# EAGLE design main_shema (EAGLE 9.2.1)
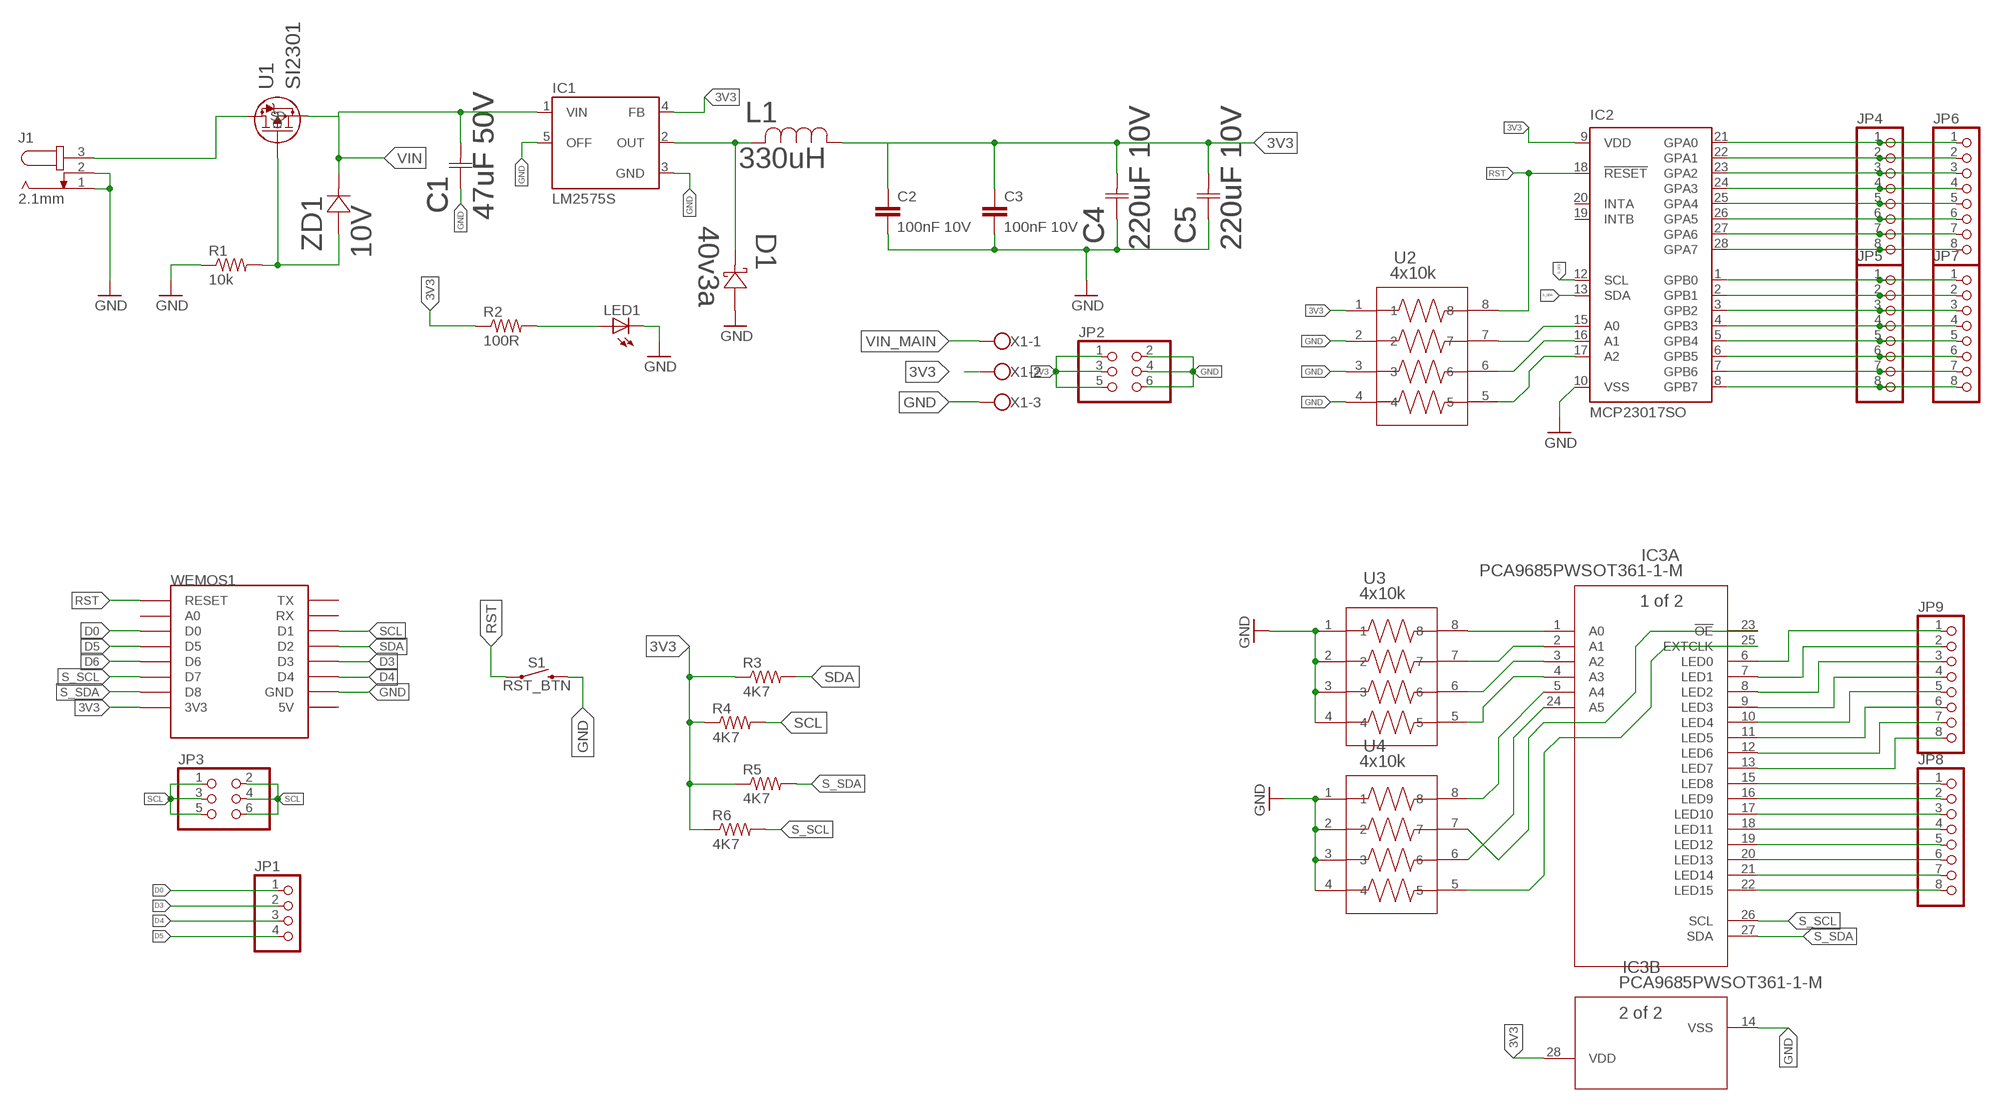
[diagram p0: schematic, sheet 1, part 1 of 2]
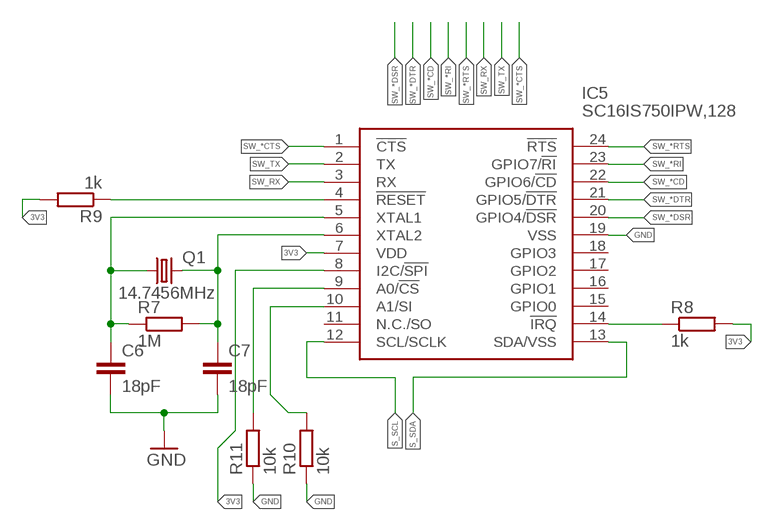
[diagram p1: schematic, sheet 1, part 2 of 2]

## Parts
C1  47uF 50V  EEE-1HA470XPCAP_EEE_D8-M  [CAP_EEE_D8-M]
C2  100nF 10V  C-EUC0603  [C0603]
C3  100nF 10V  C-EUC0603  [C0603]
C4  220uF 10V  EEE-0JA221WPCAP_EEE_D-M  [CAP_EEE_D-M]
C5  220uF 10V  EEE-0JA221WPCAP_EEE_D-M  [CAP_EEE_D-M]
C6  18pF  CAP0402-CAP  [0402-CAP]
C7  18pF  CAP0402-CAP  [0402-CAP]
D1  40v3a  CDBA340-HFCDBA-HF-M  [CDBA-HF-M]
IC1  LM2575S  [TO263-5]
IC2  MCP23017SO  [SO28W]
IC3  PCA9685PWSOT361-1-M  [SOT361-1-M]
IC5  SC16IS750IPW,128  [SOP65P640X110-24N]
J1  2.1mm  JACK-PLUG1  [SPC4078]
JP1  PINHD-1X4  [1X04]
JP2  PINHD-2X3  [2X03]
JP3  PINHD-2X3  [2X03]
JP4  PINHD-1X8  [1X08]
JP5  PINHD-1X8  [1X08]
JP6  PINHD-1X8  [1X08]
JP7  PINHD-1X8  [1X08]
JP8  PINHD-1X8/LONG  [1X08]
JP9  PINHD-1X8/LONG  [1X08]
L1  330uH  SRR1280-331K  [IND_BOURNS_SRR1280]
LED1  LED_E  [LED_1206]
Q1  14.7456MHz  CRYSTAL5X3  [CRYSTAL-SMD-5X3]
R1  10k  R-US_R0603  [R0603]
R2  100R  R-US_R0603  [R0603]
R3  4K7  R-US_R0603  [R0603]
R4  4K7  R-US_R0603  [R0603]
R5  4K7  R-US_R0603  [R0603]
R6  4K7  R-US_R0603  [R0603]
R7  1M  R-EU_R0402  [R0402]
R8  1k  R-EU_R0402  [R0402]
R9  1k  R-EU_R0402  [R0402]
R10  10k  R-EU_R0402  [R0402]
R11  10k  R-EU_R0402  [R0402]
S1  RST_BTN  MOMENTARY-SWITCH-SPST-PTH-6.0MM  [TACTILE_SWITCH_PTH_6.0MM]
U1  SI2301  SI2301CDS-T1-GE3TO-236-M  [TO-236-M]
U2  4x10k  EXB-38V103JV  [C_ARRAY_EXB38V]
U3  4x10k  EXB-38V103JVC_ARRAY_EXB38V-M  [C_ARRAY_EXB38V-M]
U4  4x10k  EXB-38V103JVC_ARRAY_EXB38V-M  [C_ARRAY_EXB38V-M]
WEMOS1  WEMOS-D1-MINI  [WEMOS-D1-MINI]
X1  W237-103  [W237-103]
ZD1  10V  DZ2J100M0LSMINI2-F5-B-M  [SMINI2-F5-B-M]

## Nets
3V3: C2.1 C3.1 C4.2 C5.2 IC1.4(FB) IC2.9(VDD) IC3.28(B:VDD) IC5.7(VDD) IC5.8(I2C/!SPI) JP2.1 JP2.3 JP2.5 L1.1 R2.1 R3.1 R4.1 R5.1 R6.1 R8.2 R9.2 U2.1 WEMOS1.3V3 X1.2
D0: JP1.1 WEMOS1.D0
D3: JP1.2 WEMOS1.D3
D4: JP1.3 WEMOS1.D4
D5: JP1.4 WEMOS1.D5
D6: WEMOS1.D6
GND: C1.1 C2.2 C3.2 C4.1 C5.1 C6.2 C7.2 D1.2 IC1.3(GND) IC1.5(OFF) IC2.10(VSS) IC3.14(B:VSS) IC5.19(VSS) J1.1 J1.2 JP2.2 JP2.4 JP2.6 LED1.C R1.1 R10.1 R11.1 S1.3 U2.2 U2.3 U2.4 U3.1 U3.2 U3.3 U3.4 U4.1 U4.2 U4.3 U4.4 WEMOS1.GND X1.3
N$1: LED1.A R2.2
N$2: R1.2 U1.1(G) ZD1.2
N$3: IC2.21(GPA0) JP4.1 JP6.1
N$4: IC2.22(GPA1) JP4.2 JP6.2
N$5: IC3.6(A:LED0) JP9.1
N$6: IC3.7(A:LED1) JP9.2
N$7: IC3.8(A:LED2) JP9.3
N$8: D1.1 IC1.2(OUT) L1.2
N$9: IC2.15(A0) U2.7
N$10: IC3.9(A:LED3) JP9.4
N$11: IC2.23(GPA2) JP4.3 JP6.3
N$12: IC2.16(A1) U2.6
N$13: IC2.17(A2) U2.5
N$14: IC3.10(A:LED4) JP9.5
N$15: IC2.24(GPA3) JP4.4 JP6.4
N$16: IC2.25(GPA4) JP4.5 JP6.5
N$17: IC2.26(GPA5) JP4.6 JP6.6
N$18: IC3.11(A:LED5) JP9.6
N$19: IC3.12(A:LED6) JP9.7
N$20: IC3.13(A:LED7) JP9.8
N$21: IC2.27(GPA6) JP4.7 JP6.7
N$22: IC2.28(GPA7) JP4.8 JP6.8
N$23: IC2.1(GPB0) JP5.1 JP7.1
N$24: IC2.2(GPB1) JP5.2 JP7.2
N$25: IC2.3(GPB2) JP5.3 JP7.3
N$26: IC2.4(GPB3) JP5.4 JP7.4
N$27: IC2.5(GPB4) JP5.5 JP7.5
N$28: IC2.6(GPB5) JP5.6 JP7.6
N$29: IC2.7(GPB6) JP5.7 JP7.7
N$30: IC2.8(GPB7) JP5.8 JP7.8
N$31: IC3.15(A:LED8) JP8.1
N$32: IC3.16(A:LED9) JP8.2
N$33: IC3.17(A:LED10) JP8.3
N$34: IC3.18(A:LED11) JP8.4
N$35: IC3.19(A:LED12) JP8.5
N$36: IC3.20(A:LED13) JP8.6
N$37: IC3.21(A:LED14) JP8.7
N$38: IC3.22(A:LED15) JP8.8
N$39: IC3.1(A:A0) U3.8
N$40: IC3.2(A:A1) U3.7
N$41: IC3.3(A:A2) U3.6
N$42: IC3.4(A:A3) U3.5
N$43: IC3.5(A:A4) U4.8
N$44: IC3.24(A:A5) U4.6
N$45: IC3.23(A:!OE) U4.7
N$46: IC3.25(A:EXTCLK) U4.5
N$47: C6.1 IC5.5(XTAL1) Q1.1 R7.1
N$48: C7.1 IC5.6(XTAL2) Q1.3 R7.2
N$49: IC5.4(!RESET) R9.1
N$50: IC5.14(!IRQ) R8.1
N$51: IC5.9(A0/!CS) R11.2
N$52: IC5.10(A1/SI) R10.2
RST: IC2.18(!RESET) S1.1 U2.8 WEMOS1.RESET
S_SCL: IC2.12(SCL) IC3.26(A:SCL) IC5.12(SCL/SCLK) R6.2 WEMOS1.D7
S_SDA: IC2.13(SDA) IC3.27(A:SDA) IC5.13(SDA/VSS) R5.2 WEMOS1.D8
SCL: JP3.1 JP3.3 JP3.5 R4.2 WEMOS1.D1
SDA: JP3.2 JP3.4 JP3.6 R3.2 WEMOS1.D2
SW_*CD: IC5.22(GPIO6/!CD)
SW_*CTS: IC5.1(!CTS)
SW_*DSR: IC5.20(GPIO4/!DSR)
SW_*DTR: IC5.21(GPIO5/!DTR)
SW_*RI: IC5.23(GPIO7/!RI)
SW_*RTS: IC5.24(!RTS)
SW_RX: IC5.3(RX)
SW_TX: IC5.2(TX)
VIN: C1.2 IC1.1(VIN) U1.2(S) ZD1.1
VIN_MAIN: J1.3 U1.3(D) X1.1
Unconnected: IC2.19(INTB) IC2.20(INTA) IC5.11(N.C./SO) IC5.15(GPIO0) IC5.16(GPIO1) IC5.17(GPIO2) IC5.18(GPIO3) WEMOS1.5V WEMOS1.A0 WEMOS1.RX WEMOS1.TX

## Library data of the parts
C1 = Custom Parts by IcE:EEE-1HA470XP; MANUFACTURER_PART_NUMBER: EEE1HA470XP; VENDOR: Panasonic
C2 C3 = rcl:C-EU: CAPACITOR, European symbol
C4 C5 = Custom Parts by IcE:EEE-0JA221WP; MANUFACTURER_PART_NUMBER: EEE0JA221WP; VENDOR: Panasonic
C6 C7 = SparkFun:CAP: Capacitor Standard 0603 ceramic capacitor, and 0.1" leaded capacitor.
D1 = Custom Parts by IcE:CDBA340-HF; MANUFACTURER_PART_NUMBER: CDBA340HF; VENDOR: Comchip
IC1 = v-reg-3:LM2575: National Semiconductor <http://www.national.com> 1.0A "Simple Switcher"(c) 52kHz, Vout 1.23-37V (HV: 57V), Vin 40V (HV: 60V), 50µA standby current
IC2 = microchip:MCP23017: http://ww1.microchip.com/downloads/en/DeviceDoc/21952a.pdf Source: http://ww1.microchip.com/downloads/en/DeviceDoc/21952a.pdf; MF: MICROCHIP; MPN: MCP23017-E/SO; OC_FARNELL: 1332087; OC_NEWARK: 31K2958
IC3 = Custom Parts by IcE:PCA9685PW; MANUFACTURER_PART_NUMBER: PCA9685PW; VENDOR: NXP
IC5 = SC16IS750IPW_128:SC16IS750IPW,128: NXP - SC16IS750IPW,128 - SINGLE UART FIFO 5MBPS 3.6V TSSOP-24, FULL REEL Source: Datasheet <https://componentsearchengine.com/Datasheets/2/SC16IS750IPW,128.pdf>; DESCRIPTION: NXP - SC16IS750IPW,128 - SINGLE UART FIFO 5MBPS 3.6V TSSOP-24, FULL REEL; HEIGHT: 1.1mm; MANUFACTURER_NAME: NXP; MANUFACTURER_PART_NUMBER: SC16IS750IPW,128
J1 = con-jack:JACK-PLUG: DC POWER JACK Power Jack, DC, Right Angle, Through Hole, Rated 5A at 16VDC, PC Terminals Distributor: Farnell (www.Farnell.de) Drawing: 84N1161.pdf / 84N1162.pdf Manufacturer: SPC Technology (www.spctechnology.com) Type: SPC4077 / SPC 4078; OC_FARNELL: unknown; OC_NEWARK: unknown
JP1 = pinhead:PINHD-1X4: PIN HEADER
JP2 JP3 = pinhead_2:PINHD-2X3: PIN HEADER
JP4-JP7 = pinhead_2:PINHD-1X8: PIN HEADER
JP8 JP9 = pinhead_v2:PINHD-1X8: PIN HEADER
L1 = Custom Parts by IcE:SRR1280-331K; MANUFACTURER_PART_NUMBER: SRR1280331K; VENDOR: Bourns Electronics
LED1 = eagle-ltspice:LED_E: LED Source: http://www.osram.convergy.de Source: www.luxeon.com Source: www.kingbright.com; SPICEMODEL: NONE; SPICEPREFIX: D; SPICETYPE: diode
Q1 = SparkFun:CRYSTAL: Crystals Various standard crystals. Proven footprints. Spark Fun Electronics SKU : COM-00534
R1-R6 = rcl:R-US_: RESISTOR, American symbol
R7-R11 = rcl:R-EU_: RESISTOR, European symbol; SPICEPREFIX: R
S1 = SparkFun-Switches:MOMENTARY-SWITCH-SPST: Momentary Switch (Pushbutton) - SPST Normally-open (NO) SPST momentary switches (buttons, pushbuttons). Variants PTH-12MM - 12mm square, through-hole Momentary Pushbutton Switch - 12mm Square <https://www.sparkfun.com/products/9190> (COM-09190) PTH-6.0MM, PTH-6.0MM-KIT - 6.0mm square, through-hole Mini Pushbutton Switch <https://www.sparkfun.com/products/97> (COM-00097) KIT package intended for soldering kit's - only one side of pads' copper is exposed. PTH-RIGHT-ANGLE-KIT - Right-angle, through-hole Right Angle Tactile Button <https://www.sparkfun.com/products/10791> - Used on SparkFun BigTime Watch Kit <https://www.sparkfun.com/products/11734> SMD-12MM - 12mm square, surface-mount Tactile Button - SMD (12mm) <https://www.sparkfun.com/products/12993> (COM-12993) Used on SparkFun PicoBoard <https://www.sparkfun.com/products/11888> SMD-4.5MM - 4.5mm Square Trackball Switch Used on SparkFun Blackberry Trackballer Breakout <https://www.sparkfun.com/products/13169> SMD-4.6MMX2.8MM - 4.60mm x 2.80mm, surface mount Used on SparkFun SAMD21 Mini Breakout <https://www.sparkfun.com/products/13664> SMD-5.2MM, SMD-5.2-REDUNDANT - 5.2mm square, surface-mount Mini Pushbutton Switch - SMD <https://www.sparkfun.com/products/8720> (COM-08720) Used on Arduino Pro Mini <https://www.sparkfun.com/products/11114> REDUNDANT package connects both switch circuits together SMD-6.0X3.5MM - 6.0 x 3.5mm, surface mount Momentary Reset Switch SMD <https://www.sparkfun.com/products/8229> (COM-08229) SMD-6.2MM-TALL - 6.2mm square, surface mount Tactile Button - SMD (6mm) <https://www.sparkfun.com/products/12992> Used on SparkFun Digital Sandbox <https://www.sparkfun.com/products/12651> SMD-RIGHT-ANGLE - Right-angle, surface mount Used on SparkFun Block for Intel® Edison - Arduino <https://www.sparkfun.com/products/13036>; PROD_ID: SWCH-08441; SF_SKU: COM-00097
U1 = Custom Parts by IcE:SI2301CDS-T1-GE3; MANUFACTURER_PART_NUMBER: SI2301CDST1GE3; VENDOR: Vishay
U2-U4 = Custom Parts by IcE:EXB-38V103JV; MANUFACTURER_PART_NUMBER: EXB38V103JV; VENDOR: Panasonic
WEMOS1 = esp8266modules:WEMOS-D1-MINI: WeMos.cc D1 mini ESP8266 module
X1 = con-wago-500:W237-103: WAGO SCREW CLAMP; MPN: 237-103; OC_FARNELL: unknown; OC_NEWARK: 18M7116
ZD1 = Custom Parts by IcE:DZ2J100M0L; MANUFACTURER_PART_NUMBER: DZ2J100M0L; VENDOR: Panasonic

## Board
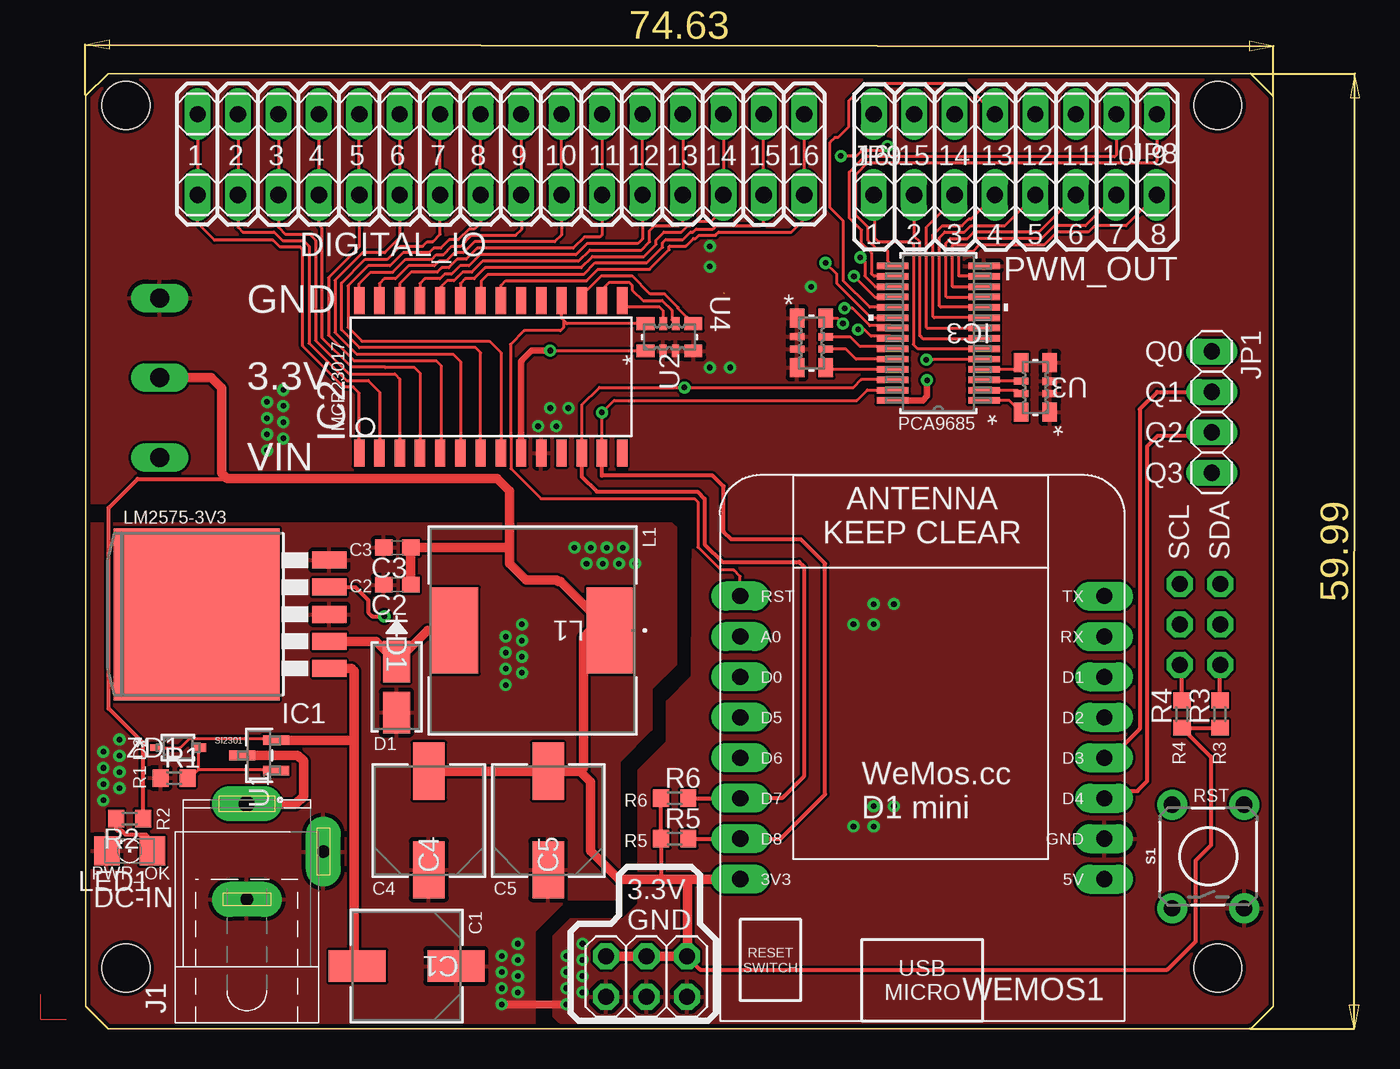
[diagram p2: board, top side]
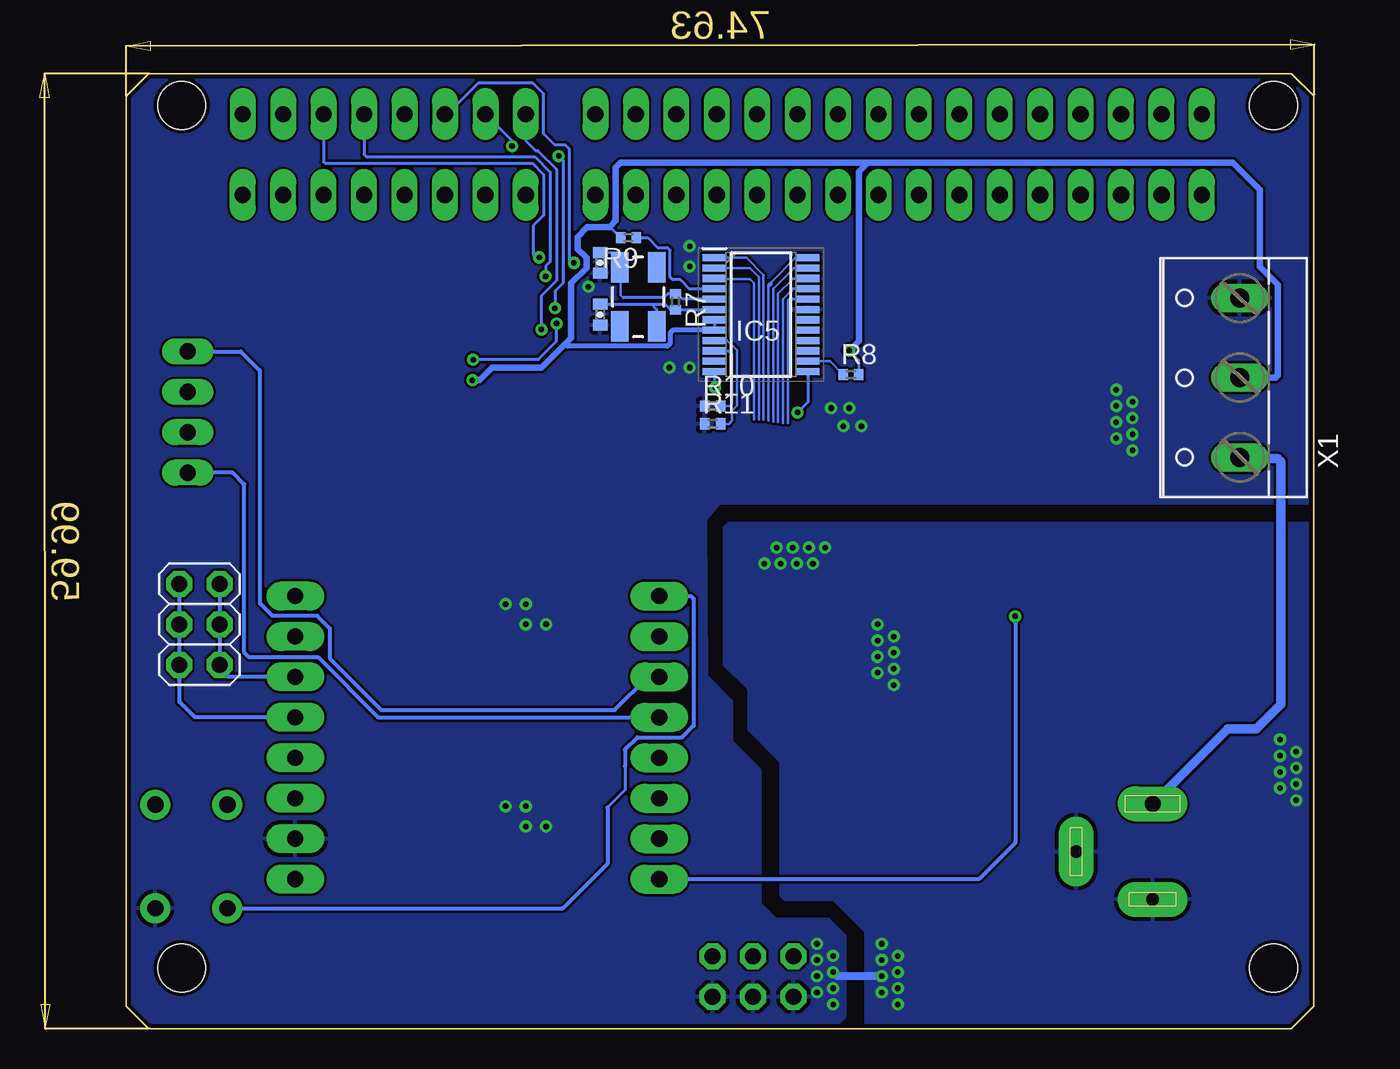
[diagram p3: board, bottom side, seen from below]

Size 74.6 x 60 mm. Coordinates in mm from the lower left corner, seen from the top.
Outline: 73.15,59.99 1.42,60 0,58.62 0,1.93 0,1.42 1.42,0 1.63,0 73.15,0 73.18,0 74.6,1.42 74.6,58.57
Outline: 73.15,59.99 73.16,60
Outline: 74.6,58.57 74.6,58.57
Outline: 73.15,59.99 73.18,59.99 74.6,58.57
Outline: 74.6,0 74.6,0
Copper layers (1*16): Top 0.035mm / dielectric 1.5mm / Bottom 0.035mm
Design rules "default *": minimum track width 6mil, minimum drill 0.2mm, track to track 6mil, track to pad 6mil, pad to pad 6mil, via to via 6mil, smd to smd 6mil, copper to edge 10mil, drill to drill 6mil, minimum pad ring 12mil, minimum via ring 8mil, stop-mask expansion 4mil, vias tented up to drill 0mil, thermal gap 10mil
Holes 3 mm at 2.54,3.81 2.54,58 71.12,58 71.12,3.81

### Footprints (pad centres in the part's own frame; a part is rotated, then mirrored left to right if it is on the bottom)
CAP_EEE_D8-M = smd 3.581 x 1.981: 1 -3.099,0; 2 3.099,0
C0603 = smd 1.1 x 1: 1 -0.85,0; 2 0.85,0
CAP_EEE_D-M = smd 3.581 x 1.981: 1 -3.099,0; 2 3.099,0
0402-CAP = smd 0.7 x 0.9: 1 -0.65,0; 2 0.65,0
CDBA-HF-M = smd 2.616 x 1.702: 1 -1.6,0; 2 1.6,0
TO263-5 = smd 1.067 x 2.159: 1 -3.404,-5.791; 2 -1.702,-5.791; 3 0,-5.791; 4 1.702,-5.791; 5 3.404,-5.791 | smd 10.8 x 10.41: 6 0,2.54
SO28W = smd 0.65 x 1.7: 1 -7.62,-4.78; 2 -6.35,-4.78; 3 -5.08,-4.78; 4 -3.81,-4.78; 5 -2.54,-4.78; 6 -1.27,-4.78; 7 0,-4.78; 8 1.27,-4.78; 9 2.54,-4.78; 10 3.81,-4.78; 11 5.08,-4.78; 12 6.35,-4.78; 13 7.62,-4.78; 14 8.89,-4.78; 15 8.89,4.78; 16 7.62,4.78; 17 6.35,4.78; 18 5.08,4.78; 19 3.81,4.78; 20 2.54,4.78; 21 1.27,4.78; 22 0,4.78; 23 -1.27,4.78; 24 -2.54,4.78; 25 -3.81,4.78; 26 -5.08,4.78; 27 -6.35,4.78; 28 -7.62,4.78
SOT361-1-M = smd 1.981 x 0.406: 1 -2.87,4.225; 2 -2.87,3.575; 3 -2.87,2.925; 4 -2.87,2.275; 5 -2.87,1.625; 6 -2.87,0.975; 7 -2.87,0.325; 8 -2.87,-0.325; 9 -2.87,-0.975; 10 -2.87,-1.625; 11 -2.87,-2.275; 12 -2.87,-2.925; 13 -2.87,-3.575; 14 -2.87,-4.225; 15 2.87,-4.225; 16 2.87,-3.575; 17 2.87,-2.925; 18 2.87,-2.275; 19 2.87,-1.625; 20 2.87,-0.975; 21 2.87,-0.325; 22 2.87,0.325; 23 2.87,0.975; 24 2.87,1.625; 25 2.87,2.275; 26 2.87,2.925; 27 2.87,3.575; 28 2.87,4.225
SOP65P640X110-24N = smd 1.475 x 0.45: 1 -2.938,3.575; 2 -2.938,2.925; 3 -2.938,2.275; 4 -2.938,1.625; 5 -2.938,0.975; 6 -2.938,0.325; 7 -2.938,-0.325; 8 -2.938,-0.975; 9 -2.938,-1.625; 10 -2.938,-2.275; 11 -2.938,-2.925; 12 -2.938,-3.575; 13 2.938,-3.575; 14 2.938,-2.925; 15 2.938,-2.275; 16 2.938,-1.625; 17 2.938,-0.975; 18 2.938,-0.325; 19 2.938,0.325; 20 2.938,0.975; 21 2.938,1.625; 22 2.938,2.275; 23 2.938,2.925; 24 2.938,3.575
SPC4078 = drill 0.8 pad 2.184 long: 1 -3,0; 2 0,-4.8 | drill 1 pad 2.184 long: 3 3,0
1X04 = drill 1.016 long: 1 -3.81,0; 2 -1.27,0; 3 1.27,0; 4 3.81,0
2X03 = drill 1.016 octagon: 1 -2.54,-1.27; 2 -2.54,1.27; 3 0,-1.27; 4 0,1.27; 5 2.54,-1.27; 6 2.54,1.27
1X08 = drill 1.016 long: 1 -8.89,0; 2 -6.35,0; 3 -3.81,0; 4 -1.27,0; 5 1.27,0; 6 3.81,0; 7 6.35,0; 8 8.89,0
IND_BOURNS_SRR1280 = smd 2.896 x 5.41: 1 -4.851,0; 2 4.851,0
LED_1206 = smd 1.6 x 1.803: A -1.422,0; C 1.422,0
CRYSTAL-SMD-5X3 = smd 1.9 x 1.1: 1 -1.85,-1.15; 2 1.85,-1.15; 3 1.85,1.15; 4 -1.85,1.15
R0603 = smd 1 x 1.1: 1 -0.85,0; 2 0.85,0
R0402 = smd 0.6 x 0.7: 1 -0.5,0; 2 0.5,0
TACTILE_SWITCH_PTH_6.0MM = drill 1.016 pad 1.88: 1 -3.251,2.261; 2 3.251,2.261; 3 -3.251,-2.261; 4 3.251,-2.261
TO-236-M = smd 0.61 x 1.626: 1 -0.95,-1.067; 2 0.95,-1.067; 3 0,1.067
C_ARRAY_EXB38V = smd 0.807 x 1.107: 1 -0.854,1.504; 4 -0.854,-1.504; 5 0.854,-1.504; 8 0.854,1.504 | smd 0.807 x 0.45: 2 -0.854,0.395; 3 -0.854,-0.385; 6 0.854,-0.395; 7 0.854,0.385
C_ARRAY_EXB38V-M = smd 0.909 x 1.209: 1 -0.904,1.554; 4 -0.904,-1.554; 5 0.904,-1.554; 8 0.904,1.554 | smd 0.909 x 0.45: 2 -0.904,0.395; 3 -0.904,-0.385; 6 0.904,-0.395; 7 0.904,0.385
WEMOS-D1-MINI = drill 1.016 pad 1.829 long: 3V3 -10.16,-10.16; 5V 12.7,-10.16; A0 -10.16,5.08; D0 -10.16,2.54; D1 12.7,2.54; D2 12.7,0; D3 12.7,-2.54; D4 12.7,-5.08; D5 -10.16,0; D6 -10.16,-2.54; D7 -10.16,-5.08; D8 -10.16,-7.62; GND 12.7,-7.62; RESET -10.16,7.62; RX 12.7,5.08; TX 12.7,7.62
W237-103 = drill 1.194 long: 1 -5,-1.29; 2 0,-1.29; 3 5,-1.29
SMINI2-F5-B-M = smd 0.914 x 0.406: 1 -1.295,0 | smd 0.914 x 0.559: 2 1.295,0

### Placement (x,y rotation side)
C1  20.17,3.94 180 top
C2  19.58,27.89 180 top
C3  19.58,30.23 180 top
C4  21.56,13.08 90 top
C5  29.06,13.08 90 top
C6  44.83,48.11 270 bottom
C7  44.83,44.86 270 bottom
D1  19.53,21.46 270 top
IC1  9.53,26.04 90 top
IC2  24.82,40.94 0 top
IC3  53.57,43.69 180 top
IC5  34.72,44.86 0 bottom
J1  10.13,11.13 90 top
JP1  70.74,38.73 270 top
JP2  35.23,3.28 180 top
JP3  70,25.4 90 bottom
JP4  36.25,57.45 180 top
JP5  15.93,57.45 0 top
JP6  36.25,52.37 180 top
JP7  15.93,52.37 0 top
JP8  58.39,57.45 180 top
JP9  58.39,52.37 0 top
L1  28.07,25.02 180 top
LED1  2.77,11.18 180 top
Q1  42.44,45.97 270 bottom
R1  5.56,15.75 0 top
R2  2.77,13.21 180 top
R3  71.25,19.76 90 top
R4  68.86,19.76 90 top
R5  37.01,11.94 0 top
R6  37.01,14.48 0 top
R7  40.11,45.67 270 bottom
R8  29.08,41.1 0 bottom
R9  43.05,49.68 180 bottom
R10  37.77,39.12 0 bottom
R11  37.77,38 0 bottom
S1  70.51,10.82 90 top
U1  10.9,17.17 90 top
U2  36.68,43.43 90 top
U3  59.66,40.28 180 top
U4  45.59,43.08 0 top
WEMOS1  51.28,19.56 0 top
X1  5.94,40.89 90 bottom
ZD1  5.82,17.65 0 top

### Tracks (layer width: path | path; a pad name or v marks a point on that pad's centre or on a via)
3V3  (via drill 0.35)
  Top 0.203: U2.1 29.2,42.58 v29.18,42.6
  Top 0.254: R6.1 R5.1 36.16,9.67 35.89,9.4 | IC1.4 16.94,27.74 17.75,26.92 17.75,26.16 18.01,25.91 v18.77,25.91 | R2.1 3.62,17.95 1.45,20.11 1.45,32.72 3.28,34.54 9.09,34.54 9.12,34.57 | R3.1 R4.1 70.69,17.08 70.69,11.53 69.72,10.57 69.72,5.49 67.94,3.71 38.61,3.71 JP2.1
  Top 0.406: IC2.9 27.36,41.83 arc-45 27.43,42.01 28.02,42.6 v29.18,42.6 | IC3.28 52.59,39.46 52.86,39.73 v52.86,40.74
  Top 0.61: C4.2 C5.2 31.06,16.18 | 31.06,16.18 31.27,16.38 31.27,24.56 31.73,25.02 L1.1 29.84,28.09 29.69,28.09 29.59,28.19 27.66,28.19 26.64,29.21 26.64,30.28 | 31.06,16.18 31.73,15.52 31.73,11.18 33.5,9.4 35.89,9.4 37.82,9.4 | 37.82,9.4 WEMOS1.3V3 | 26.64,30.28 26.64,33.78 25.86,34.57 9.12,34.57 8.89,34.57 8.56,34.9 8.56,40.23 7.9,40.89 X1.2 | JP2.5 JP2.3 JP2.1 37.82,4.6 37.82,9.4 | C2.1 C3.1 26.59,30.23 26.64,30.28
  Bottom 0.152: R8.2 28.58,42 v29.18,42.6
  Bottom 0.203: IC5.7 IC5.8 | 44.2,50.42 44.2,50.33 R9.2
  Bottom 0.254: v18.77,25.91 18.77,11.68 21.06,9.4 WEMOS1.3V3
  Bottom 0.305: IC5.8 40.27,43.88 40.44,43.71 40.44,43.05 40.62,42.87 46.86,42.87 47.01,43.02
  Bottom 0.406: v29.18,42.6 28.57,43.21 28.57,53.85 28.02,54.41 | X1.2 2.39,40.89 2.26,41.02 2.26,46.74 3.4,47.88 3.4,52.7 5.11,54.41 28.02,54.41 | v52.86,40.74 52.4,40.74 51.62,41.52 48.51,41.52 47.01,43.02 46.66,43.38 46.66,46.82 45.7,47.78 45.7,48.43 46.25,48.98 46.25,49.73 45.64,50.34 44.27,50.34 44.2,50.42 43.87,50.75 43.87,54.1 43.56,54.41 28.02,54.41
D0
  Bottom 0.254: WEMOS1.D0 41.83,22.1 43.92,20.02 58.58,20.02 61.82,23.26 61.82,25.15 62.6,25.93 65.41,25.93 66.21,26.73 66.21,41.34 67.41,42.55 JP1.1
D3
  Top 0.254: JP1.2 67.31,40.01 66.22,38.91 66.22,18.85 64.9,17.53 64.49,17.53 WEMOS1.D3
D4
  Top 0.254: WEMOS1.D4 64.44,14.94 66.06,14.94 66.67,15.54 66.67,36.58 67.33,37.24 70.51,37.24 JP1.3
D5
  Bottom 0.254: WEMOS1.D5 58.77,19.56 62.55,23.34 66.9,23.34 67.18,23.62 67.18,34.19 67.92,34.92 JP1.4
GND  (via drill 0.35)
  Top 0.508: v26.14,1.52 v30.2,1.52
  Bottom 0.508: v27.15,3.3 29.95,3.3 v30.2,3.56
  other vias: 29.18,38.99 30.33,38.99 28.42,37.85 29.57,37.85 26.14,4.57 27.15,4.32 27.15,5.33 26.14,3.56 26.14,2.54 27.15,2.29 30.2,4.57 31.22,4.32 31.22,5.33 31.22,3.3 30.2,2.54 31.22,2.29 26.39,24.64 27.41,24.38 27.41,25.4 26.39,23.62 27.41,23.37 26.39,22.61 27.41,22.35 26.39,21.59 31.47,29.21 31.72,30.23 30.71,30.23 32.49,29.21 32.74,30.23 33.5,29.21 33.76,30.23 34.52,29.21 2.13,15.11 1.12,15.37 1.12,14.35 2.13,16.13 1.12,16.38 2.13,17.14 1.12,17.4 2.13,18.16 12.42,37.08 11.4,37.34 11.4,36.32 12.42,38.1 11.4,38.35 12.42,39.12 11.4,39.37 12.42,40.13 49.5,26.67 48.23,25.4 49.5,25.4 50.77,26.67 49.5,13.97 48.23,12.7 49.5,12.7 50.77,13.97 39.22,49.15 39.22,47.88 39.22,41.53 40.49,41.53 45.57,46.61
  pour Top (isolate 0.152): -0.03,33.02 -0.03,58.67 1.24,59.94 73.13,59.94 74.65,58.42 74.65,1.52 73.13,0 30.2,0 29.44,0.76 29.44,5.84 30.45,6.86 33.76,6.86 34.77,7.87 34.77,16.26 36.55,18.03 36.55,20.57 38.13,22.15 38.18,32 37.31,33.02
  pour Bottom (isolate 0.152): -0.03,33.02 -0.03,58.67 1.24,59.94 73.13,59.94 74.65,58.42 74.65,1.52 73.13,0 30.2,0 29.44,0.76 29.44,5.84 30.45,6.86 33.76,6.86 34.77,7.87 34.77,16.26 36.55,18.03 36.55,20.57 38.13,22.15 38.18,32 37.31,33.02
  pour Bottom (isolate 0.152): -0.03,31.75 36.8,31.75 37.06,31.5 37.06,22.86 35.53,21.34 35.53,18.8 33.5,16.76 33.5,8.38 33.25,8.13 30.2,8.13 28.17,6.1 28.17,0.25 27.91,0 1.5,0 -0.03,1.52
  pour Top (isolate 0.152): -0.03,31.75 36.8,31.75 37.06,31.5 37.06,22.86 35.53,21.34 35.53,18.8 33.5,16.76 33.5,8.38 33.25,8.13 30.2,8.13 28.17,6.1 28.17,0.25 27.91,0 1.5,0 -0.03,1.52
N$1
  Top 0.254: LED1.A 3.94,11.43 3.94,12.04 3.79,12.19 2.52,12.19 2.26,12.45 2.01,12.45 1.92,12.53 R2.2
N$2
  Top 0.203: 7.11,16.29 ZD1.2 | U1.1 11.4,16.22 11.33,16.29 7.11,16.29 | R1.2 6.57,15.75 7.11,16.29
N$3
  Top 0.203: IC2.21 26.09,46.69 26.39,46.99 31.47,46.99 32.18,47.7 35.43,47.7 36.65,48.92 36.65,49.12 36.7,49.17 37.71,49.17 38.17,49.63 38.31,49.63 38.52,49.84 39.58,49.84 39.78,50.04 44.35,50.04 45.06,50.75 45.06,52.3 JP6.1 JP4.1
N$4
  Top 0.203: IC2.22 24.87,45.78 24.87,46.99 25.27,47.4 31.3,47.4 32.01,48.11 35.26,48.11 36.25,49.09 36.25,49.38 36.44,49.57 37.54,49.57 38.01,50.04 38.15,50.04 38.35,50.24 39.41,50.24 39.62,50.44 42.39,50.44 42.6,50.65 JP6.2 JP4.2
N$5
  Top 0.203: JP9.1 49.55,52.32 49.55,49.68 49.8,49.44 51.81,49.44 51.99,49.26 51.99,42.98 52.26,42.71 IC3.6
N$6
  Top 0.203: JP9.2 52.05,49.78 52.4,49.43 52.4,43.54 52.6,43.33 56.41,43.33 IC3.7
N$7
  Top 0.203: IC3.8 52.84,44.01 52.81,44.04 52.81,50.34 54.59,52.12 JP9.3
N$8
  Top 0.61: IC1.2 18.26,24.33 D1.1 21.49,25.02 L1.2
N$9
  Top 0.203: U2.7 36.3,45.09 36.04,45.34 34.09,45.34 IC2.15
N$10
  Top 0.203: JP9.4 55.6,50.85 55.45,50.85 55.05,50.44 53.81,50.44 53.21,49.85 53.21,44.76 53.3,44.66 IC3.9
N$11
  Top 0.203: IC2.23 23.55,46.81 23.85,47.12 24.42,47.12 25.11,47.8 31.13,47.8 31.85,48.52 35.09,48.52 35.84,49.26 35.84,49.55 36.33,50.04 37.43,50.04 37.84,50.44 37.98,50.44 38.26,50.72 39.32,50.72 40.06,51.46 JP6.3 JP4.3
N$12
  Top 0.203: IC2.16 32.44,46.43 32.88,46.88 34.16,46.88 34.34,46.7 34.34,46.41 35,45.74 36.21,45.74 36.82,45.13 36.82,44.54 U2.6
N$13
  Top 0.203: U2.5 37.23,45.24 37.23,45.3 36.38,46.15 35.46,46.15 34.32,47.3 32.4,47.3 31.17,46.06 IC2.17
N$14
  Top 0.203: JP9.5 57.73,50.44 55.62,50.44 55.22,50.04 53.98,50.04 53.62,49.68 53.62,45.41 53.72,45.31 IC3.10
N$15
  Top 0.203: IC2.24 22.28,46.56 22.71,46.99 23.15,46.99 23.68,47.52 24.25,47.52 24.94,48.21 30.97,48.21 31.68,48.92 34.93,48.92 35.43,49.43 35.43,50.14 35.74,50.44 37.26,50.44 37.52,50.7 JP6.4 JP4.4
N$16
  Top 0.203: IC2.25 21.01,46.81 21.31,47.12 22.26,47.12 22.54,47.4 22.98,47.4 23.51,47.93 24.08,47.93 24.77,48.62 30.8,48.62 31.51,49.33 34.7,49.33 34.98,49.61 JP6.5 JP4.5
N$17
  Top 0.203: IC2.26 19.74,46.81 20.45,47.52 22.09,47.52 22.37,47.8 22.81,47.8 23.35,48.34 23.91,48.34 24.6,49.02 30.63,49.02 31.34,49.73 32.31,49.73 32.44,49.86 JP6.6 JP4.6
N$18
  Top 0.203: JP9.6 59.87,50.04 55.79,50.04 55.38,49.63 54.31,49.63 54.03,49.34 54.03,46.02 54.09,45.96 IC3.11
N$19
  Top 0.203: JP9.7 62.81,50.44 60.85,50.44 60.04,49.63 55.96,49.63 55.55,49.23 54.48,49.23 54.43,49.17 54.43,46.63 54.45,46.61 IC3.12
N$20
  Top 0.203: JP9.8 65.35,50.44 63.39,50.44 62.98,50.04 61.02,50.04 60.2,49.23 56.13,49.23 55.72,48.82 54.94,48.82 54.84,48.72 54.84,47.3 56.41,47.3 IC3.13
N$21
  Top 0.203: IC2.27 18.47,46.81 18.77,47.12 19.47,47.12 20.28,47.93 21.92,47.93 22.2,48.21 22.64,48.21 23.18,48.74 23.75,48.74 24.43,49.43 29.46,49.43 29.9,49.86 JP6.7 JP4.7
N$22
  Top 0.203: IC2.28 17.2,46.81 17.91,47.52 19.3,47.52 20.11,48.34 21.75,48.34 22.03,48.62 22.48,48.62 23.01,49.15 23.58,49.15 24.26,49.84 27.03,49.84 27.41,50.22 27.41,52.32 JP6.8 JP4.8
N$23
  Top 0.203: IC2.1 17.2,39.93 16.82,40.31 16.22,40.31 13.64,42.89 13.64,48.95 13.49,49.1 12.21,49.1 11.78,49.53 8.11,49.53 7.04,50.6 JP7.1 JP5.1
N$24
  Top 0.203: IC2.2 18.47,40.01 17.75,40.72 16.39,40.72 14.05,43.06 14.05,49.15 13.69,49.51 12.38,49.51 11.85,50.04 9.88,50.04 9.58,50.34 JP7.2 JP5.2
N$25
  Top 0.203: IC2.3 19.74,40.82 19.43,41.12 16.56,41.12 14.45,43.23 14.45,49.53 14.07,49.91 12.55,49.91 12.12,50.34 JP7.3 JP5.3
N$26
  Top 0.203: IC2.4 21.01,41.2 20.68,41.53 18.85,41.53 18.82,41.55 16.7,41.55 14.86,43.4 14.86,50.29 14.66,50.49 JP7.4 JP5.4
N$27
  Top 0.203: IC2.5 22.33,36.22 22.33,41.66 22.02,41.96 16.87,41.96 15.27,43.56 15.27,47.18 17.2,49.11 JP7.5 JP5.5
N$28
  Top 0.203: IC2.6 23.55,41.91 23.09,42.37 17.04,42.37 15.67,43.73 15.67,47.01 17.4,48.74 18.79,48.74 19.74,49.69 JP7.6 JP5.6
N$29
  Top 0.203: IC2.7 24.82,42.47 24.51,42.77 17.2,42.77 16.08,43.9 16.08,46.84 17.57,48.34 18.96,48.34 19.77,49.15 21.18,49.15 21.46,49.43 21.82,49.43 21.82,49.45 22.28,49.91 JP7.7 JP5.7
N$30
  Top 0.203: IC2.8 26.09,42.47 25.38,43.18 17.37,43.18 16.48,44.07 16.48,46.68 17.74,47.93 19.13,47.93 19.94,48.74 21.59,48.74 21.87,49.02 22.31,49.02 22.84,49.55 23.41,49.55 24.09,50.24 24.43,50.24 24.82,50.62 JP7.8 JP5.8
N$31
  Top 0.203: JP8.1 67.28,54.51 67.13,54.36 49.09,54.36 48.39,53.65 48.39,51.1 49.15,50.34 49.15,49.51 49.63,49.03 50.21,49.03 50.37,48.87 50.37,48.24 IC3.15
N$32
  Top 0.203: JP8.2 64.75,54.86 64.64,54.76 48.92,54.76 47.98,53.82 47.98,50.93 48.74,50.17 48.74,49.35 49.35,48.74 49.35,47.45 49.54,47.26 IC3.16
N$33  (via drill 0.35)
  Top 0.203: v48.67,48.45 48.95,48.18 48.95,47.28 49.61,46.61 IC3.17
  Bottom 0.203: JP8.3 62.2,54.46 62.1,54.36 49.09,54.36 48.39,53.65 48.39,51.1 49.04,50.44 49.04,48.62 48.87,48.45 v48.67,48.45
N$34  (via drill 0.35)
  Top 0.203: v48.26,47.27 49.57,45.96 IC3.18
  Bottom 0.203: JP8.4 59.66,54.91 59.51,54.76 48.92,54.76 47.98,53.82 47.98,48.18 48.26,47.89 v48.26,47.27
N$35
  Top 0.203: IC3.19 49.26,45.31 47.58,46.99 47.58,50.76 46.76,51.58 46.76,55.68 47.07,55.98 47.27,55.98 47.93,56.64 47.93,58.27 49.04,59.38 55.19,59.38 JP8.5
N$36  (via drill 0.35)
  Top 0.203: v46.48,48.11 47.17,47.42 47.17,46.82 49.33,44.66 IC3.20
  Bottom 0.203: v46.48,48.11 46.64,48.11 46.76,48.23 46.76,55.25 47.02,55.51 47.68,55.51 48.39,56.22 48.39,58.73 49.04,59.38 52.51,59.38 54.44,57.45 JP8.6
N$37  (via drill 0.35)
  Top 0.203: IC3.21 50.56,44.16 49.26,44.16 48.16,45.26 v47.68,45.26 | v50.37,55.45 50.09,55.17 48.76,55.17 48.41,54.82 v47.44,54.82
  Bottom 0.203: v47.68,45.26 47.68,46.32 47.17,46.83 47.17,54.55 v47.44,54.82 | JP8.7 50.37,55.78 v50.37,55.45
N$38  (via drill 0.35)
  Top 0.203: IC3.22 50.56,43.51 49.34,43.51 48.92,43.93 v48.52,43.93
  Bottom 0.203: v48.52,43.93 48.52,44.03 48.54,44.04 48.54,46.03 47.57,46.99 47.57,53.99 48.76,55.17 48.9,55.17 49.51,55.78 JP8.8
N$39
  Top 0.203: U3.8 58.02,39.47 56.45,39.47 IC3.1
N$40
  Top 0.203: U3.7 58.54,40.11 IC3.2
N$41
  Top 0.203: U3.6 56.52,40.68 IC3.3
N$42
  Top 0.203: U3.5 58.33,41.41 IC3.4
N$43  (via drill 0.35)
  Top 0.203: IC3.5 56.41,42.03 v52.81,42.03 | U4.8 47.24,44.63 v47.57,44.3
  Bottom 0.203: v52.81,42.03 48.72,42.03 47.57,43.18 v47.57,44.3
N$44
  Top 0.203: U4.6 47.78,42.68 48.4,42.06 IC3.24
N$45
  Top 0.203: IC3.23 50.56,42.85 48.63,42.85 48.05,43.43 46.53,43.43 U4.7
N$46
  Top 0.203: IC3.25 46.61,41.41 U4.5
N$47  (1 unrouted)
  Bottom 0.152: C6.1 43.8,48.76 43.56,48.51 43.59,48.48 Q1.1 | 43.4,45.91 43.56,46.08 43.56,47.72
  Bottom 0.203: Q1.1 43.46,47.82 | 43.46,47.82 43.22,47.82 | 43.56,47.72 43.46,47.82 | R7.1 40.57,46.17 40.83,45.91 43.4,45.91 | 40.07,46.23 39.68,45.83 IC5.5
N$48
  Bottom 0.203: C7.1 41.62,45.51 | Q1.3 41.29,45.18 41.62,45.51 | 41.62,45.51 40.76,45.51 40.42,45.17 R7.2 38.9,45.17 38.89,45.16 37.68,45.16 IC5.6
N$49
  Bottom 0.203: IC5.4 39.24,46.48 39.8,47.04 40.26,47.04 40.44,47.22 40.44,48.9 40.62,49.08 41.23,49.08 41.83,49.68 R9.1
N$50
  Bottom 0.152: R8.1 30.42,41.93 IC5.14
N$51
  Bottom 0.152: IC5.9 36.86,43.23 36.25,42.62 36.25,39.14 36.55,38.84 36.55,38.2 36.75,38 R11.2
N$52
  Bottom 0.152: R10.2 36.7,39.12 36.55,39.27 36.55,42.37 36.77,42.58 IC5.10
  Bottom 0.203: IC5.10
N$53
  Top 0.051: -2.82,2.16 -2.82,0.58 -1.22,0.58
RST
  Top 0.203: U2.8 30.24,44.29 30.03,44.5 | IC2.18 29.9,44.63 30.03,44.5 | 30.03,44.5 30.03,44.04 29.82,43.84 27.56,43.84 26.7,42.98 26.7,37.16 26.72,37.14 26.72,35.18 28.6,33.3 38.25,33.3 38.46,33.09 38.46,30.25 39.9,28.8 40.73,28.8 41.12,28.41 WEMOS1.RESET
  Bottom 0.203: 43.28,16.5 43.28,14.99 44.37,13.9
  Bottom 0.254: S1.1 47.17,7.57 44.37,10.36 44.37,13.9 | 43.28,16.5 43.28,17.53 42.5,18.31 39.69,18.31 38.96,19.04 38.96,27 39.14,27.18 WEMOS1.RESET
S_SCL  (via drill 0.35)
  Top 0.203: IC2.12 31.17,39.17 32.28,40.28 v37.62,40.28 48.23,40.28 48.71,40.76 IC3.26
  Top 0.254: IC2.12 31.17,34.69 32.12,33.73 38.43,33.73 38.89,33.27 38.89,30.43 39.99,29.32 44.82,29.32 45.11,29.03 45.11,15.85 43.74,14.48 WEMOS1.D7 R6.2
  Bottom 0.203: IC5.12 37.66,40.33 v37.62,40.28
S_SDA  (via drill 0.35)
  Top 0.203: IC2.13 v32.44,38.71 33.2,39.47 48.44,39.47 49.1,40.13 50.68,40.13 IC3.27
  Top 0.254: R5.2 WEMOS1.D8 43.66,11.94 46.46,14.73 46.46,29.21 44.93,30.73 40.56,30.73 40.08,31.22 40.08,34.06 39.4,34.75 32.44,34.75 IC2.13
  Bottom 0.203: IC5.13 31.78,39.36 v32.44,38.71
SCL
  Top 0.254: R4.2 68.86,22.73 JP3.1
  Bottom 0.254: WEMOS1.D1 68.25,22.1 68.73,22.58 JP3.1 JP3.3 JP3.5
SDA
  Top 0.254: R3.2 71.25,22.84 JP3.2
  Bottom 0.254: WEMOS1.D2 70.28,19.56 71.25,20.52 71.25,22.71 | 71.25,22.71 71.25,22.84 JP3.2 | JP3.6 JP3.4 71.27,22.73 71.25,22.71
SW_*CD
  Bottom 0.152: IC5.22 32.7,47.13 33.66,46.18 33.66,38.1
SW_*CTS
  Bottom 0.152: IC5.1 35.66,48.43 34.57,47.35 34.57,38.25
SW_*DSR
  Bottom 0.152: IC5.20 32.93,45.83 33.04,45.72 33.04,38.05
SW_*DTR
  Bottom 0.152: 33.35,38.05 33.35,45.85 32.91,46.28 32.89,46.28 32.7,46.48 IC5.21
SW_*RI
  Bottom 0.152: IC5.23 32.66,47.78 33.96,46.48 33.96,38.15
SW_*RTS
  Bottom 0.152: IC5.24 32.57,48.43 34.09,46.91 | 34.27,46.08 34.27,46.74 34.09,46.91 | 34.09,46.91 34.09,46.79 34.27,46.61 34.27,38.2
SW_RX
  Bottom 0.152: IC5.3 37.62,47.09 35.43,47.09 35.18,46.84 35.18,38.25
SW_TX
  Bottom 0.152: IC5.2 35.44,47.78 34.87,47.22 34.87,38.25
VIN
  Top 0.203: ZD1.1 5.94,17.65 6.53,18.24 11.85,18.24 U1.2
  Top 0.61: IC1.1 16.71,22.63 16.87,22.48 16.87,18.19 | 16.87,18.19 16.87,4.14 C1.2 | U1.2 16.8,18.12 16.87,18.19
VIN_MAIN
  Top 0.61: J1.3 10.16,14.1 13.18,14.1 13.69,14.61 13.69,16.82 13.34,17.17 U1.3
  Bottom 0.61: J1.3 5.41,18.85 3.62,18.85 2.08,20.38 2.08,35.64 2.26,35.81 4.57,35.81 X1.1

### Text on the board
_tNames: 1 | 2 | 3 | 4 | 5 | 6 | 7 | 8 | 9 | 10 | 11 | 12 | 13 | 14 | 15 | 16 | 16 | 15 | 14 | 13 | 12 | 11 | 10 | 9 | DIGITAL_IO | 1 | 2 | 3 | 4 | 5 | 6 | 7 | 8 | PWM_OUT | GND | MCP23017 | Q0 | 3.3V | Q1 | PCA9685 | Q2 | VIN | Q3 | LM2575-3V3 | L1 | C3 | SCL | SDA | C2 | D1 | D2 | SI2301 | D1 | R4 | R3 | R1 | R1 | R6 | RST | R2 | R5 | PWR_OK | DC-IN | C4 | C5 | C1 | 3.3V / GND | J1
200bmp: C:/Users/Ivica/Desktop/preuzmi.bmp | C:/Users/Ivica/Desktop/preuzmi.bmp